# Altium schematic sheet Isolated DCDC Converter.SchDoc: iSO
size B; VersionControl_RevNumber: 1; PageSetup: Record=PageOptions|CenterHorizontal=True|CenterVertical=True|PrintScale=0.94|XCorrection=1.00|YCorrection=1.00|PrintKind=0|BorderSize=5000000|LeftOffset=0|BottomOffset=0|Orientation=2|PaperLength=4200|PaperWidth=2970|Scale=100|PaperSource=7|PrintQuality=600|MediaType=1|DitherType=10|PrintScaleMode=1|PaperKind=A3|PaperIndex=8; Germany: ADDRESS 4; Organization: ORGANIZATION; Address1: ADDRESS 1; Address2: ADDRESS 2; Address3: ADDRESS 3; Address4: ADDRESS 4; Revision: -; ENG_APP_DATE: --/--/--; DSN_APP_DATE: --/--/--; CHK_APP_DATE: --/--/--
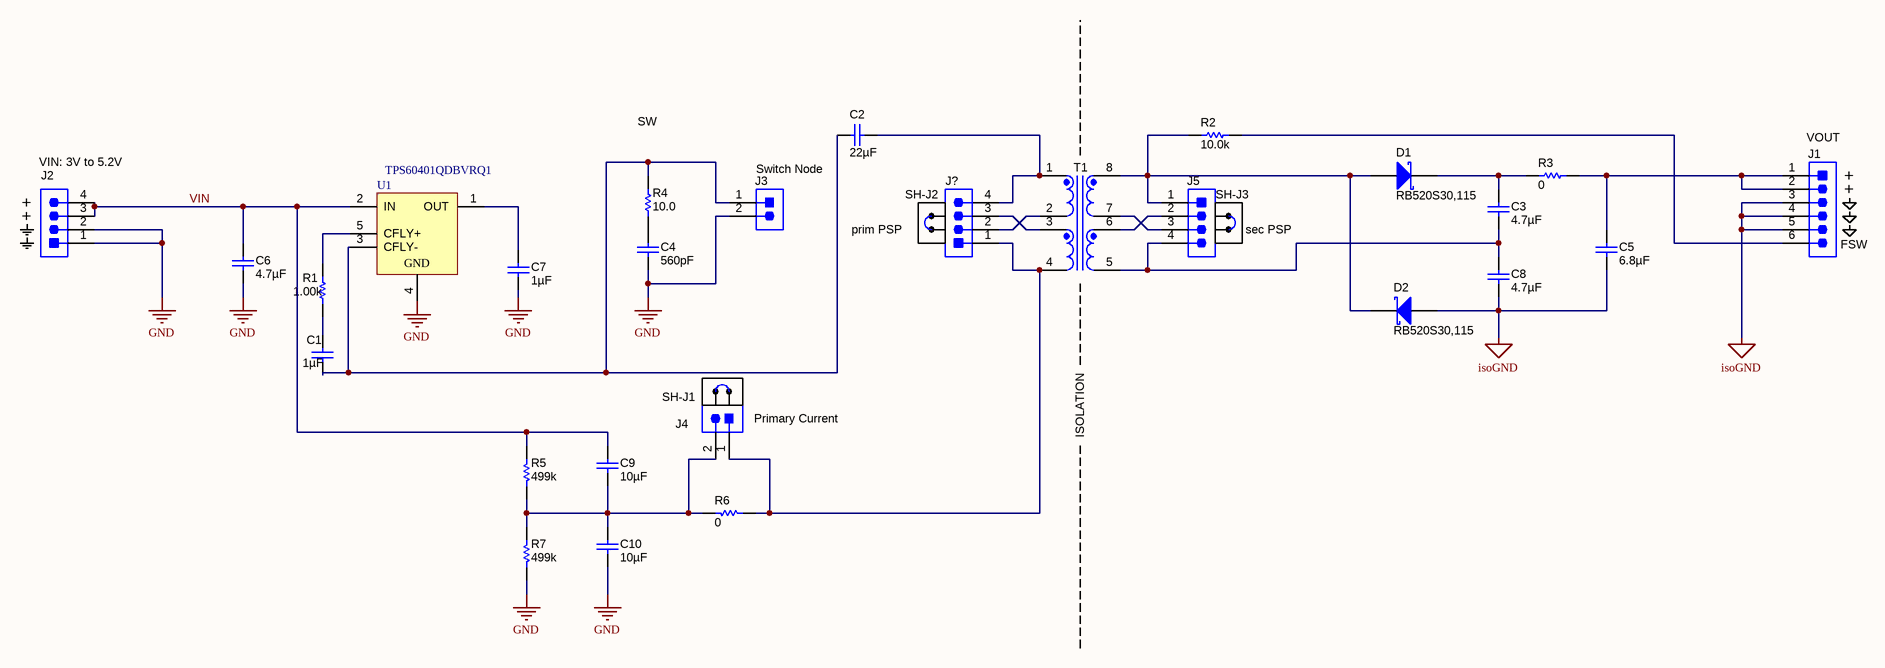
[diagram p0: Isolated DCDC Converter.SchDoc]

## Parts
C1  ValueDisplayed: 1µF  [0402S]  (hidden comment: CAP, CERM, 1uF, 10V, +/-10%, X5R, 0402)
C2  ValueDisplayed: 22µF  [1206]  (hidden comment: CAP, CERM, 22uF, 10V, +/-10%, X5R, 1206)
C3  ValueDisplayed: 4.7µF  [0603]  (hidden comment: CGB3B1X5R1A475K055AC)
C4  ValueDisplayed: 560pF  [0402]  (hidden comment: GRM155R71H561KA01D)
C5  ValueDisplayed: 6.8µF  [0603]  (hidden comment: C1608X5R1E685K080AC)
C6  ValueDisplayed: 4.7µF  [0603S]  (hidden comment: C0603C475K8PACTU)
C7  ValueDisplayed: 1µF  [0603S]  (hidden comment: GRM188R71A105KA61D)
C8  ValueDisplayed: 4.7µF  [0603]  (hidden comment: CGB3B1X5R1A475K055AC)
C9  ValueDisplayed: 10µF  [0805_HV]  (hidden comment: CAP, CERM, 10uF, 10V, +/-10%, X7R, 0805)
C10  ValueDisplayed: 10µF  [0805_HV]  (hidden comment: CAP, CERM, 10uF, 10V, +/-10%, X7R, 0805)
D1  RB520S30,115  [SOD-523]
D2  RB520S30,115  [SOD-523]
J1  61300611121  [WURTH_61300611121]  (value not drawn)
J2  61300411121  [WURTH_61300411121]  (value not drawn)
J3  61300211121  [WURTH_61300211121]  (value not drawn)
J4  61300211121  [WURTH_61300211121]  (value not drawn)
J5  61300411121  [WURTH_61300411121]  (value not drawn)
J?  61300411121  [WURTH_61300411121]  (value not drawn)
R1  value 1.00k  [0402S]  (hidden comment: RES, 1.00k ohm, 1%, 0.063W, 0402)
R2  ValueDisplayed: 10.0k  [0402]  (hidden comment: CRCW040210K0FKED)
R3  ValueDisplayed: 0  [0805_HV]  (hidden comment: CRCW08050000Z0EAHP)
R4  value 10.0  [0402]  (hidden comment: RES, 10.0 ohm, 1%, 0.063W, 0402)
R5  value 499k  [0402]  (hidden comment: RES, 499k ohm, 1%, 0.063W, 0402)
R6  ValueDisplayed: 0  [0805_HV]  (hidden comment: CRCW08050000Z0EAHP)
R7  value 499k  [0402]  (hidden comment: RES, 499k ohm, 1%, 0.063W, 0402)
SH-J1  969102-0000-DA  [SNT-100-BK-G]  (value not drawn)
SH-J2  969102-0000-DA  [SNT-100-BK-G]  (value not drawn)
SH-J3  969102-0000-DA  [SNT-100-BK-G]  (value not drawn)
T1  750314839  [Wurth_750314445]  (value not drawn)
U1  TPS60401QDBVRQ1  [DBV0005A_N]

## Nets
GND: C4.2 C6.2 C7.2 C10.2 J2.1 J2.2 J3.2 R7.1 U1.4(GND)
isoGND: C5.2 C8.2 D2.2(A) J1.3 J1.4 J1.5
VIN: C6.1 C9.1 J2.3 J2.4 R5.2 U1.2(IN)
NetC1_1: C1.1 R1.2
NetC1_2: C1.2 C2.2 J3.1 R4.2 U1.3(CFLY-)
NetC2_1: C2.1 J?.4 T1.1
NetC3_1: C3.1 D1.1(K) R3.1
NetC3_2: C3.2 C8.1 J5.4 T1.5
NetC4_1: C4.1 R4.1
NetC5_1: C5.1 J1.1 J1.2 R3.2
NetC7_1: C7.1 U1.1(OUT)
NetC9_2: C9.2 C10.1 J4.2 R5.1 R6.2 R7.2
NetD1_2: D1.2(A) D2.1(K) J5.1 R2.1 T1.8
NetJ1_6: J1.6 R2.2
NetJ4_1: J4.1 J?.1 R6.1 T1.4
NetJ5_2: J5.2 T1.6
NetJ5_3: J5.3 T1.7
NetJ?_2: J?.2 T1.2
NetJ?_3: J?.3 T1.3
NetR1_1: R1.1 U1.5(CFLY+)

## Notes on the sheet
- (near J2) VIN: 3V to 5.2V
- SW
- Switch Node
- (near J1) VOUT
- (near J2) +
- (near SH-J2) prim PSP
- (near SH-J3) sec PSP
- (near J1) +
- (near J1) FSW
- (near J4) Primary Current
- ISOLATION
- DWG. NO.
- REV.
- SHT.
- THIS DOCUMENT AND THE DATA DISCLOSED HEREIN OR HEREWITH IS THE PROPERTY OF ALTIUM LIMITED AND MAY BE FREELY DISTRIBUTED IN WHOLE. NO RIGHTS ARE RESERVED OR EXPRESS OR IMPLIED WARANTEE GIVEN.
- REVISION
- DESCRIPTION
- DATE
- APPROVED
- ENG:
- APPROVALS
- PROJECT
- DSN:
- CHK:
- REFERENCE DOCUMENTS
- PROJECT REVISION:
- TITLE
- DOCUMENT REVISION:
- DESIGN ITEM:
- BOM:
- FAB DWG:
- PCB DWG:
- ASSY DWG:
- SCALE:
- SIZE
- B
- CAGE CODE
- FILE NAME
- DWG NO.
- SHEET
- OF
- REV

## Library data of the parts
C1 = GRM155R61A105KE15D: Manufacturer: MuRata; Polarized: N; CompType: Capacitor; U/M: EA; Cap_F: 0.000001; Tolerance_%: 10; Value1: Unknown; TaMin_C: -55; TaMax_C: 85; Cap_Case: 0402; SymbolVersion: 2008-07-09; Value: 1uF; PartNumber: GRM155R61A105KE15D; PackageReference: 0402; RoHS: Y; VDC_V: 10; Value2: 10V; MountType: SMT; Technology: Ceramic; TempCo: X5R; Published: 2008-06-19; Publisher: Texas Instruments; LatestRevisionDate: 2014-05-23; ComponentLink1Description: Datasheet link; ComponentLink1URL: http://search.murata.co.jp/Ceramy/PnsearchViewAction.do?HnOFG=ON&HnNFG=ON&SEL_CNT=50&sLang=en&sKey=GRM155R61A105KE15D&x=9&y=9&search=startwith; Supplier 1: Digi-Key; Supplier Part Number 1: 490-3890-1-ND; Supplier 2: Mouser; Supplier Part Number 2: 81-GRM155R61A105KE15; Supplier 3: Farnell; Supplier Part Number 3: 1735523
C2 = GRM31CR61A226KE19L: Manufacturer: MuRata; Polarized: N; CompType: Capacitor; U/M: EA; Cap_F: 0.000022; Tolerance_%: 10; Value1: Unknown; TaMin_C: -55; TaMax_C: 85; SymbolVersion: 2008-07-09; Value: 22uF; PartNumber: GRM31CR61A226KE19L; PackageReference: 1206; RoHS: Y; VDC_V: 10; Value2: 10V; MountType: SMT; Technology: Ceramic; TempCo: X5R; Cap_Case: 1206; Published: 2008-06-19; Publisher: Texas Instruments; LatestRevisionDate: 2014-05-23; ComponentLink1Description: Datasheet link; ComponentLink1URL: http://search.murata.co.jp/Ceramy/PnsearchViewAction.do?HnOFG=ON&HnNFG=ON&SEL_CNT=50&sLang=en&sKey=GRM31CR61A226KE19L&x=9&y=9&search=startwith; Supplier 1: Digi-Key; Supplier Part Number 1: GRM31CR61A226KE19L-ND; Supplier 2: Mouser; Supplier Part Number 2: 81-GRM31CR61A226KE9L; Supplier 3: Farnell; Supplier Part Number 3: 1907515
C3 C8 = CGB3B1X5R1A475K055AC: CAP, CERM, 4.7 µF, 10 V, +/- 10%, X5R, 0603; Manufacturer: TDK; Polarized: N; CompType: Capacitor; Value: 4.7uF; U/M: EA; Cap_F: 0.0000047; Tolerance_%: 10; Value1: Unknown; Value2: 10V; TaMin_C: -55; TaMax_C: 85; SymbolVersion: 2008-07-09; PartNumber: CGB3B1X5R1A475K055AC; PackageReference: 0603; RoHS: Y; VDC_V: 10; MountType: SMT; Technology: Ceramic; TempCo: X5R; Cap_Case: 0603; Published: 2008-06-19; Publisher: Texas Instruments; LatestRevisionDate: 2014-11-05; ComponentLink1Description: Datasheet link; ComponentLink1URL: http://www.tdk.com/pdf/mlcc_product_guide_A12.pdf; Supplier 1: Digi-Key; Supplier Part Number 1: 445-7482-1-ND
C4 = GRM155R71H561KA01D: CAP, CERM, 560pF, 50V, +/-10%, X7R, 0402; Manufacturer: MuRata; Polarized: N; CompType: Capacitor; U/M: EA; Cap_F: 0.00000000056; Tolerance_%: 10; Value1: Unknown; VDC_V: 50; TaMin_C: -55; TaMax_C: 125; SymbolVersion: 2008-07-09; Value: 560pF; PartNumber: GRM155R71H561KA01D; PackageReference: 0402; RoHS: Y; Value2: 50V; MountType: SMT; Technology: Ceramic; TempCo: X7R; Cap_Case: 0402; Published: 2008-06-19; Publisher: Texas Instruments; LatestRevisionDate: 2014-05-23; ComponentLink1Description: Datasheet link; ComponentLink1URL: http://search.murata.co.jp/Ceramy/PnsearchViewAction.do?HnOFG=ON&HnNFG=ON&SEL_CNT=50&sLang=en&sKey=GRM155R71H561KA01D&x=9&y=9&search=startwith; Supplier 1: Digi-Key; Supplier Part Number 1: 490-1301-1-ND; Supplier 2: Mouser; Supplier Part Number 2: 81-GRM155R71H561KA01
C5 = C1608X5R1E685K080AC: CAP, CERM, 6.8 µF, 25 V, +/- 10%, X5R, 0603; Manufacturer: TDK; Polarized: N; CompType: Capacitor; Value: 6.8uF; U/M: EA; Cap_F: 0.0000068; Tolerance_%: 10; Value1: Unknown; VDC_V: 25; Value2: 25V; TaMin_C: -55; TaMax_C: 85; SymbolVersion: 2008-07-09; PartNumber: C1608X5R1E685K080AC; PackageReference: 0603; RoHS: Y; MountType: SMT; Technology: Ceramic; TempCo: X5R; Cap_Case: 0603; Published: 2008-06-19; Publisher: Texas Instruments; LatestRevisionDate: 2014-11-05; ComponentLink1Description: Datasheet link; ComponentLink1URL: http://product.tdk.com/capacitor/mlcc/en/documents/mlcc_commercial_general_en.pdf; Supplier 1: Digi-Key; Supplier Part Number 1: 445-14145-6-ND
C6 = C0603C475K8PACTU: CAP, CERM, 4.7uF, 10V, +/-10%, X5R, 0603; Manufacturer: Kemet; Polarized: N; CompType: Capacitor; U/M: EA; Cap_F: 0.0000047; Tolerance_%: 10; ESR_Ohm: 0.006; Value1: 0.006 ohm; IRMS_A: 7.24; TaMin_C: -55; TaMax_C: 85; Cap_Case: 0603; SymbolVersion: 2008-07-09; Value: 4.7uF; PartNumber: C0603C475K8PACTU; PackageReference: 0603; RoHS: Y; VDC_V: 10; Value2: 10V; MountType: SMT; Technology: Ceramic; TempCo: X5R; Published: 2008-06-19; Publisher: Texas Instruments; LatestRevisionDate: 2014-05-23; ComponentLink1Description: Datasheet link; ComponentLink1URL: http://www.kemet.com/kemet/web/homepage/kechome.nsf/vapubfiles/F3102_Y5V.pdf/$file/F3102_Y5V.pdf; Supplier 1: Digi-Key; Supplier Part Number 1: 399-5503-1-ND; Supplier 2: Mouser; Supplier Part Number 2: 80-C0603C475K8P; Supplier 3: Farnell; Supplier Part Number 3: 1572625
C7 = GRM188R71A105KA61D: CAP, CERM, 1uF, 10V, +/-10%, X7R, 0603; Manufacturer: MuRata; Polarized: N; CompType: Capacitor; U/M: EA; Cap_F: 0.000001; Tolerance_%: 10; ESR_Ohm: 0.011; Value1: 0.011 ohm; TaMin_C: -55; TaMax_C: 125; Cap_Case: 0603; SymbolVersion: 2008-07-09; Value: 1uF; PartNumber: GRM188R71A105KA61D; PackageReference: 0603; RoHS: Y; VDC_V: 10; Value2: 10V; MountType: SMT; Technology: Ceramic; TempCo: X7R; Published: 2008-06-19; Publisher: Texas Instruments; LatestRevisionDate: 2014-06-11; ComponentLink1Description: Datasheet link; ComponentLink1URL: http://search.murata.co.jp/Ceramy/PnsearchViewAction.do?HnOFG=ON&HnNFG=ON&SEL_CNT=50&sLang=en&sKey=GRM188R71A105KA61D&x=9&y=9&search=startwith; Supplier 1: Digi-Key; Supplier Part Number 1: 490-3899-1-ND; Supplier 2: Mouser; Supplier Part Number 2: 81-GRM188R71A105KA1D; Supplier 3: Farnell; Supplier Part Number 3: 1845766
C9 C10 = GRM21BR71A106KE51L: Manufacturer: MuRata; Polarized: N; CompType: Capacitor; U/M: EA; Cap_F: 0.00001; Tolerance_%: 10; ESR_Ohm: 0.003; Value1: 0.003 ohm; TaMin_C: -55; TaMax_C: 125; Cap_Case: 0805; SymbolVersion: 2008-07-09; Value: 10uF; PartNumber: GRM21BR71A106KE51L; PackageReference: 0805; RoHS: Y; VDC_V: 10; Value2: 10V; MountType: SMT; Technology: Ceramic; TempCo: X7R; Published: 2008-06-19; Publisher: Texas Instruments; LatestRevisionDate: 2014-05-23; ComponentLink1Description: Datasheet link; ComponentLink1URL: http://search.murata.co.jp/Ceramy/PnsearchViewAction.do?HnOFG=ON&HnNFG=ON&SEL_CNT=50&sLang=en&sKey=GRM21BR71A106KE51L&x=9&y=9&search=startwith; Supplier 1: Digi-Key; Supplier Part Number 1: 490-3905-1-ND; Supplier 2: Mouser; Supplier Part Number 2: 81-GRM21BR71A106KE51; Supplier 3: Farnell; Supplier Part Number 3: 1828828
D1 D2 = RB520S30,115: Diode, Schottky, 30 V, 0.2 A, SOD-523; Manufacturer: NXP Semiconductor; U/M: EA; Vf_V: 0.6; Value: 30V; Value1: 0.2A; Value2: 0.6V; Io_A: 0.2; Vr_V: 30; TJmax_C: 150; CompType: Diode; SymbolVersion: 2008-12-08; PartNumber: RB520S30,115; PackageReference: SOD-523; MountType: SMT; Type: Schottky; RoHS: Y; Published: 2008-06-26; Publisher: Texas Instruments; LatestRevisionDate: 2014-11-05; ComponentLink1Description: Datasheet link; ComponentLink1URL: http://www.nxp.com/documents/data_sheet/RB520S30.pdf; Supplier 1: Digi-Key; Supplier Part Number 1: 568-8470-1-ND; Supplier 2: Mouser; Supplier Part Number 2: 771-RB520S30115
J1 = 61300611121: Header, 2.54 mm, 6x1, Gold, TH; Manufacturer: Wurth Elektronik eiSos; SymbolCreator: a0412235; U/M: EA; SymbolVersion: 2013-08-30; PartNumber: 61300611121; ClassName: Header; PackageReference: Header, 2.54mm, 6x1, TH; CompType: Header; RoHS: Y; MountType: TH; ComponentLink1Description: Datasheet Link; ComponentLink1URL: http://katalog.we-online.de/em/datasheet/6130xx11121.pdf; Publisher: Texas Instruments; LatestRevisionDate: 2014-11-10; Supplier 1: Digi-Key; Supplier Part Number 1: 732-5319-ND; Supplier 2: Mouser; Supplier Part Number 2: 710-61300611121; Supplier 3: Farnell; Supplier Part Number 3: 2356158
J2 J5 J? = 61300411121: Header, 2.54 mm, 4x1, Gold, TH; Manufacturer: Wurth Elektronik eiSos; SymbolCreator: a0412235; U/M: EA; SymbolVersion: 2013-08-30; PartNumber: 61300411121; ClassName: Header; PackageReference: Header, 2.54mm, 4x1, TH; CompType: Header; RoHS: Y; MountType: TH; ComponentLink1Description: Datasheet Link; ComponentLink1URL: http://katalog.we-online.de/em/datasheet/6130xx11121.pdf; Publisher: Texas Instruments; LatestRevisionDate: 2014-11-05; Supplier 1: Digi-Key; Supplier Part Number 1: 732-5317-ND
J3 J4 = 61300211121: Header, 2.54 mm, 2x1, Gold, TH; Manufacturer: Wurth Elektronik eiSos; SymbolCreator: a0412235; U/M: EA; SymbolVersion: 2013-10-31; PartNumber: 61300211121; ClassName: Header; PackageReference: Header, 2.54mm, 2x1, TH; CompType: Header; RoHS: Y; MountType: TH; ComponentLink1Description: Datasheet Link; ComponentLink1URL: http://katalog.we-online.de/em/datasheet/6130xx11121.pdf; Publisher: Texas Instruments; Supplier 1: Digi-Key; Supplier Part Number 1: 732-5315-ND; Supplier 2: Mouser; Supplier Part Number 2: 710-61300211121; Supplier 3: Farnell; Supplier Part Number 3: 2356153
  J3: LatestRevisionDate: 2014-11-10
  J4: LatestRevisionDate: 2014-11-05
R1 = CRCW04021K00FKED: Manufacturer: Vishay-Dale; CompType: Resistor; Res_ohm: 1000; Value_Code: 1k00; Tolerance_%: 1; Power_W: 0.063; VDC_V: 50; TempCo: 100 ppm/C; EIA_Code: E96; U/M: EA; SymbolVersion: 2009-05-29; PartNumber: CRCW04021K00FKED; PackageReference: 0402; RoHS: Y; Value1: 1%; Value2: 0.063W; MountType: SMT; Technology: Thick Film; Published: 2008-06-26; Publisher: Texas Instruments; LatestRevisionDate: 2013-11-01; ComponentLink1Description: Datasheet link; ComponentLink1URL: http://www.vishay.com/docs/20035/dcrcwe3.pdf; Supplier 1: Digi-Key; Supplier Part Number 1: 541-1.00KLCT-ND; Supplier 2: Mouser; Supplier Part Number 2: 71-CRCW0402-1.0K-E3; Supplier 3: Farnell; Supplier Part Number 3: 1469662
R2 = CRCW040210K0FKED: RES, 10.0 k, 1%, 0.063 W, 0402; Manufacturer: Vishay-Dale; CompType: Resistor; Value: 10.0k; Res_ohm: 10000; Value_Code: 10k0; Tolerance_%: 1; Power_W: 0.063; Value2: 0.063W; VDC_V: 50; TempCo: 100 ppm/C; EIA_Code: E96; U/M: EA; SymbolVersion: 2009-05-29; PartNumber: CRCW040210K0FKED; PackageReference: 0402; RoHS: Y; Value1: 1%; MountType: SMT; Technology: Thick Film; Published: 2008-06-26; Publisher: Texas Instruments; LatestRevisionDate: 2014-10-30; ComponentLink1Description: Datasheet link; ComponentLink1URL: http://www.vishay.com/docs/20035/dcrcwe3.pdf; Supplier 1: Digi-Key; Supplier Part Number 1: 541-10.0KLCT-ND; Supplier 2: Mouser; Supplier Part Number 2: 71-CRCW0402-10K-E3; Supplier 3: Farnell; Supplier Part Number 3: 1469669
R3 R6 = CRCW08050000Z0EAHP: RES, 0, 5%, 0.333 W, 0805; Manufacturer: Vishay-Dale; CompType: Resistor; Value: 0; Value_Code: 0000; Tolerance_%: 5; Power_W: 0.333; Value2: 0.333W; TempCo: 200 ppm/C; EIA_Code: E24; U/M: EA; SymbolVersion: 2009-05-29; PartNumber: CRCW08050000Z0EAHP; PackageReference: 0805; RoHS: Y; Res_ohm: 0; Value1: 5%; MountType: SMT; Technology: Thick Film; Published: 2008-06-26; Publisher: Texas Instruments; LatestRevisionDate: 2014-11-05; ComponentLink1Description: Datasheet link; ComponentLink1URL: http://www.vishay.com/docs/20043/crcwhpe3.pdf; Supplier 1: Digi-Key; Supplier Part Number 1: 541-0.0TBCT-ND; Supplier 2: Mouser; Supplier Part Number 2: 71-CRCW08050000Z0EAH; Supplier 3: Farnell; Supplier Part Number 3: 1798268
R4 = CRCW040210R0FKED: Manufacturer: Vishay-Dale; CompType: Resistor; Res_ohm: 10; Value_Code: 10R0; Tolerance_%: 1; Power_W: 0.063; VDC_V: 50; TempCo: 100 ppm/C; EIA_Code: E96; U/M: EA; SymbolVersion: 2009-05-29; PartNumber: CRCW040210R0FKED; PackageReference: 0402; RoHS: Y; Value1: 1%; Value2: 0.063W; MountType: SMT; Technology: Thick Film; Published: 2008-06-26; Publisher: Texas Instruments; LatestRevisionDate: 2013-11-01; ComponentLink1Description: Datasheet link; ComponentLink1URL: http://www.vishay.com/docs/20035/dcrcwe3.pdf; Supplier 1: Digi-Key; Supplier Part Number 1: 541-10.0LCT-ND; Supplier 2: Mouser; Supplier Part Number 2: 71-CRCW0402-10-E3; Supplier 3: Farnell; Supplier Part Number 3: 9238999
R5 R7 = CRCW0402499KFKED: Manufacturer: Vishay-Dale; CompType: Resistor; Res_ohm: 499000; Tolerance_%: 1; Power_W: 0.063; VDC_V: 50; TempCo: 100 ppm/C; EIA_Code: E96; U/M: EA; SymbolVersion: 2009-05-29; PartNumber: CRCW0402499KFKED; PackageReference: 0402; RoHS: Y; Value_Code: 499k; Value1: 1%; Value2: 0.063W; MountType: SMT; Technology: Thick Film; Published: 2008-06-26; Publisher: Texas Instruments; LatestRevisionDate: 2013-11-01; ComponentLink1Description: Datasheet link; ComponentLink1URL: http://www.vishay.com/docs/20035/dcrcwe3.pdf; Supplier 1: Digi-Key; Supplier Part Number 1: 541-499KLCT-ND; Supplier 2: Mouser; Supplier Part Number 2: 71-CRCW0402-499K-E3; Supplier 3: Farnell; Supplier Part Number 3: 1469723
SH-J1-SH-J3 = 969102-0000-DA: Shunt, 100mil, Gold plated, Black; Manufacturer: 3M; Alternate Manufacturer: Samtec; Value: 1x2; Note: You can "mate" this to a header by matching the designator.  i.e. use SH-J3 for header J3; ClassName: Shunt; CompType: Shunt; PartNumber: 969102-0000-DA; RoHS: Y; PackageReference: Shunt; MountType: N/A; ComponentLink1Description: Datasheet Link; ComponentLink1URL: http://multimedia.3m.com/mws/mediawebserver?66666UuZjcFSLXTtNxTElXf6EVuQEcuZgVs6EVs6E666666--; Publisher: Texas Instruments; LatestRevisionDate: 2014-05-15; Alternate PartNumber: SNT-100-BK-G; Supplier 1: Digi-Key; Supplier Part Number 1: 3M9580-ND; Supplier 2: Mouser; Supplier Part Number 2: 517-9691020000DA
T1 = 750314839: Transformer, 3mH, SMT; Manufacturer: Wurth Elektronik eiSos; SymbolCreator: a0799628; DCR_Ohm: 1.2; U/M: EA; SymbolVersion: 2014-05-22; PartNumber: 750314839; CompType: Transformer; PackageReference: 9.78x10.54x9.14mm; MountType: SMT; RoHS: Y; ComponentLink1Description: Datasheet Link; ComponentLink1URL: https://sps06.itg.ti.com/sites/KMS/crossdivteams/altium/docs/ComponentDatasheets/750314839pre (2).pdf; Value: 3mH; Publisher: Texas Instruments; LatestRevisionDate: 2014-05-27
U1 = CMP-0391-00011-2: -1.8 to -5.25 V, Inverting Charge Pump Regulator, 60 mA, 1.8 to 5.25 V Input, -40 to 125 degC, 5-pin SOT23 (DBV5), Green (RoHS & no Sb/Br); Manufacturer: Texas Instruments; Iout(Max)(A): 0.06; Efficiency(Typ)(%): >90; Vin(Min)(V): 1.8; Topology: Inverting Buck/Boost; Vin(Max)(V): 5.25; Iq(Typ)(mA): 0.065; Switching Frequency(Max)(kHz): 30; PackageReference: DBV0005A; Eco-Plan: Green (RoHS & no Sb/Br); ComponentLink1URL: http://www.ti.com/; ComponentLink1Description: Manufacturer URL; DatasheetVersion: SGLS246A; PackageDescription: 5-Pin Plastic Small Outline, Body 1.60 Ãƒâ€” 2.90 mm, Pitch 0.95 mm; ComponentLink3Description: Package Specification; ComponentLink2URL: http://www.ti.com/general/docs/lit/getliterature.tsp?genericPartNumber=TPS60401-Q1&fileType=pdf; ComponentLink3URL: http://www.ti.com/litv/pdf/mpds018i; Vout(Max)(V): -5.25; PartNumber: TPS60401QDBVRQ1; Mounting Technology: Surface Mount; Vout(Min)(V): -1.8; ComponentLink2Description: Datasheet; PackageVersion: 4073253-4/K; Code_JEDEC: MO-178